# Altium project COM Board.PrjPcb (part 2 of 2)
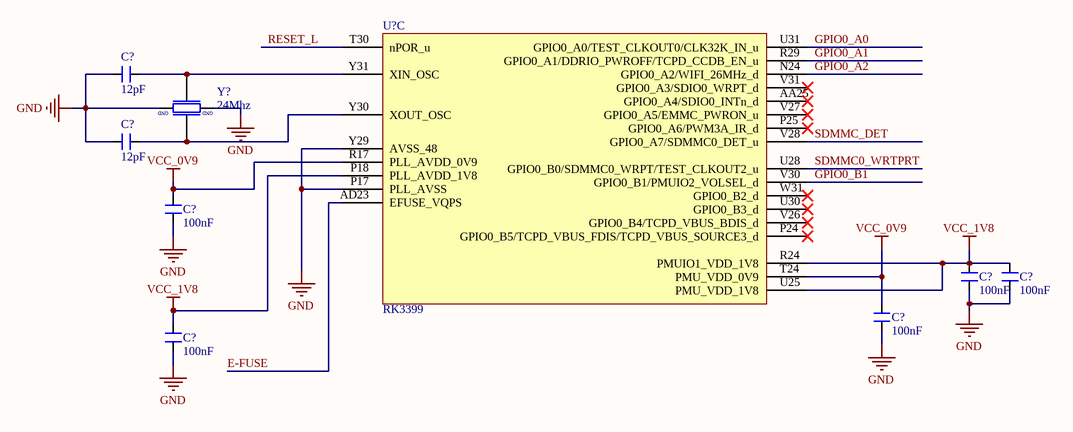
[diagram p9: System PMU pins.SchDoc]

## Nets that join several sheets
GND: RK3399_LPDDR4_Pins (R?#1.1 R?#2.1), SDRAM0 (58 pins), SDRAM_1 (58 pins), EMMC_RK3399 (22 pins), PowerPins_RK3399 (232 pins), PMIC_RK808 (47 pins), System PMU pins (11 pins)
VCC: SDRAM0 (52 pins), SDRAM_1 (52 pins)
VCC_1V8: PMIC_RK808 (C?#18.2 C?#19.2 L?#1.2 U?#10.63), System PMU pins (6 pins)
DDR0_A0: RK3399_LPDDR4_Pins (U?#1.F2), SDRAM0 (U?#4.H2 U?#4.R2)
DDR0_A1: RK3399_LPDDR4_Pins (U?#1.F1), SDRAM0 (U?#4.J2 U?#4.P2)
DDR0_A2: RK3399_LPDDR4_Pins (U?#1.G1), SDRAM0 (U?#4.H9 U?#4.R9)
DDR0_A3: RK3399_LPDDR4_Pins (U?#1.G2), SDRAM0 (U?#4.H10 U?#4.R10)
DDR0_A4: RK3399_LPDDR4_Pins (U?#1.H2), SDRAM0 (U?#4.H11 U?#4.R11)
DDR0_A5: RK3399_LPDDR4_Pins (U?#1.H1), SDRAM0 (U?#4.J11 U?#4.P11)
DDR0_CKE0: RK3399_LPDDR4_Pins (U?#1.E1), SDRAM0 (U?#4.J4 U?#4.P4)
DDR0_CKE1: RK3399_LPDDR4_Pins (U?#1.F5), SDRAM0 (U?#4.J5 U?#4.P5)
DDR0_CLK0_N: RK3399_LPDDR4_Pins (U?#1.J4), SDRAM0 (U?#4.J9)
DDR0_CLK0_P: RK3399_LPDDR4_Pins (U?#1.H4), SDRAM0 (U?#4.J8)
DDR0_CLK1_N: RK3399_LPDDR4_Pins (U?#1.J5), SDRAM0 (U?#4.P9)
DDR0_CLK1_P: RK3399_LPDDR4_Pins (U?#1.H5), SDRAM0 (U?#4.P8)
DDR0_CS0N: RK3399_LPDDR4_Pins (U?#1.M6), SDRAM0 (U?#4.H4)
DDR0_CS1N: RK3399_LPDDR4_Pins (U?#1.B1), SDRAM0 (U?#4.H3)
DDR0_CS2N: RK3399_LPDDR4_Pins (U?#1.M5), SDRAM0 (U?#4.R4)
DDR0_CS3N: RK3399_LPDDR4_Pins (U?#1.C2), SDRAM0 (U?#4.R3)
DDR0_D0: RK3399_LPDDR4_Pins (U?#1.AB2), SDRAM0 (U?#4.B2)
DDR0_D1: RK3399_LPDDR4_Pins (U?#1.AB1), SDRAM0 (U?#4.C2)
DDR0_D2: RK3399_LPDDR4_Pins (U?#1.AA2), SDRAM0 (U?#4.E2)
DDR0_D3: RK3399_LPDDR4_Pins (U?#1.AA1), SDRAM0 (U?#4.F2)
DDR0_D4: RK3399_LPDDR4_Pins (U?#1.Y2), SDRAM0 (U?#4.F4)
DDR0_D5: RK3399_LPDDR4_Pins (U?#1.Y1), SDRAM0 (U?#4.E4)
DDR0_D6: RK3399_LPDDR4_Pins (U?#1.W1), SDRAM0 (U?#4.C4)
DDR0_D7: RK3399_LPDDR4_Pins (U?#1.W2), SDRAM0 (U?#4.B4)
DDR0_D8: RK3399_LPDDR4_Pins (U?#1.AF2), SDRAM0 (U?#4.B11)
DDR0_D9: RK3399_LPDDR4_Pins (U?#1.AE2), SDRAM0 (U?#4.C11)
DDR0_D10: RK3399_LPDDR4_Pins (U?#1.AF1), SDRAM0 (U?#4.E11)
DDR0_D11: RK3399_LPDDR4_Pins (U?#1.AD2), SDRAM0 (U?#4.F11)
DDR0_D12: RK3399_LPDDR4_Pins (U?#1.AE1), SDRAM0 (U?#4.F9)
DDR0_D13: RK3399_LPDDR4_Pins (U?#1.AD1), SDRAM0 (U?#4.E9)
DDR0_D14: RK3399_LPDDR4_Pins (U?#1.AC1), SDRAM0 (U?#4.C9)
DDR0_D15: RK3399_LPDDR4_Pins (U?#1.AC2), SDRAM0 (U?#4.B9)
DDR0_D16: RK3399_LPDDR4_Pins (U?#1.V1), SDRAM0 (U?#4.AA2)
DDR0_D17: RK3399_LPDDR4_Pins (U?#1.V2), SDRAM0 (U?#4.Y2)
DDR0_D18: RK3399_LPDDR4_Pins (U?#1.U1), SDRAM0 (U?#4.V2)
DDR0_D19: RK3399_LPDDR4_Pins (U?#1.U2), SDRAM0 (U?#4.U2)
DDR0_D20: RK3399_LPDDR4_Pins (U?#1.T1), SDRAM0 (U?#4.U4)
DDR0_D21: RK3399_LPDDR4_Pins (U?#1.T2), SDRAM0 (U?#4.V4)
DDR0_D22: RK3399_LPDDR4_Pins (U?#1.R2), SDRAM0 (U?#4.Y4)
DDR0_D23: RK3399_LPDDR4_Pins (U?#1.R1), SDRAM0 (U?#4.AA4)
DDR0_D24: RK3399_LPDDR4_Pins (U?#1.P1), SDRAM0 (U?#4.AA11)
DDR0_D25: RK3399_LPDDR4_Pins (U?#1.P2), SDRAM0 (U?#4.Y11)
DDR0_D26: RK3399_LPDDR4_Pins (U?#1.N1), SDRAM0 (U?#4.V11)
DDR0_D27: RK3399_LPDDR4_Pins (U?#1.M1), SDRAM0 (U?#4.U11)
DDR0_D28: RK3399_LPDDR4_Pins (U?#1.N2), SDRAM0 (U?#4.U9)
DDR0_D29: RK3399_LPDDR4_Pins (U?#1.L1), SDRAM0 (U?#4.V9)
DDR0_D30: RK3399_LPDDR4_Pins (U?#1.M2), SDRAM0 (U?#4.Y9)
DDR0_D31: RK3399_LPDDR4_Pins (U?#1.L2), SDRAM0 (U?#4.AA9)
DDR0_DM0: RK3399_LPDDR4_Pins (U?#1.Y5), SDRAM0 (U?#4.C3)
DDR0_DM1: RK3399_LPDDR4_Pins (U?#1.AC5), SDRAM0 (U?#4.C10)
DDR0_DM2: RK3399_LPDDR4_Pins (U?#1.U5), SDRAM0 (U?#4.Y3)
DDR0_DM3: RK3399_LPDDR4_Pins (U?#1.P5), SDRAM0 (U?#4.Y10)
DDR0_DQS0_N: RK3399_LPDDR4_Pins (U?#1.AA4), SDRAM0 (U?#4.E3)
DDR0_DQS0_P: RK3399_LPDDR4_Pins (U?#1.Y4), SDRAM0 (U?#4.D3)
DDR0_DQS1_N: RK3399_LPDDR4_Pins (U?#1.AD4), SDRAM0 (U?#4.E10)
DDR0_DQS1_P: RK3399_LPDDR4_Pins (U?#1.AC4), SDRAM0 (U?#4.D10)
DDR0_DQS2_N: RK3399_LPDDR4_Pins (U?#1.V4), SDRAM0 (U?#4.V3)
DDR0_DQS2_P: RK3399_LPDDR4_Pins (U?#1.U4), SDRAM0 (U?#4.W3)
DDR0_DQS3_N: RK3399_LPDDR4_Pins (U?#1.R4), SDRAM0 (U?#4.V10)
DDR0_DQS3_P: RK3399_LPDDR4_Pins (U?#1.P4), SDRAM0 (U?#4.W10)
DDR1_A0: RK3399_LPDDR4_Pins (U?#2.B10), SDRAM_1 (U?#6.H2 U?#6.R2)
DDR1_A1: RK3399_LPDDR4_Pins (U?#2.A10), SDRAM_1 (U?#6.J2 U?#6.P2)
DDR1_A2: RK3399_LPDDR4_Pins (U?#2.B9), SDRAM_1 (U?#6.H9 U?#6.R9)
DDR1_A3: RK3399_LPDDR4_Pins (U?#2.A9), SDRAM_1 (U?#6.H10 U?#6.R10)
DDR1_A4: RK3399_LPDDR4_Pins (U?#2.B8), SDRAM_1 (U?#6.H11 U?#6.R11)
DDR1_A5: RK3399_LPDDR4_Pins (U?#2.A8), SDRAM_1 (U?#6.J11 U?#6.P11)
DDR1_CKE0: RK3399_LPDDR4_Pins (U?#2.A5), SDRAM_1 (U?#6.J4 U?#6.P4)
DDR1_CKE1: RK3399_LPDDR4_Pins (U?#2.E6), SDRAM_1 (U?#6.J5 U?#6.P5)
DDR1_CLK0_N: RK3399_LPDDR4_Pins (U?#2.D8), SDRAM_1 (U?#6.J9)
DDR1_CLK0_P: RK3399_LPDDR4_Pins (U?#2.D9), SDRAM_1 (U?#6.J8)
DDR1_CLK1_N: RK3399_LPDDR4_Pins (U?#2.E8), SDRAM_1 (U?#6.P9)
DDR1_CLK1_P: RK3399_LPDDR4_Pins (U?#2.E9), SDRAM_1 (U?#6.P8)
DDR1_CS0N: RK3399_LPDDR4_Pins (U?#2.F12), SDRAM_1 (U?#6.H4)
DDR1_CS1N: RK3399_LPDDR4_Pins (U?#2.A2), SDRAM_1 (U?#6.H3)
DDR1_CS2N: RK3399_LPDDR4_Pins (U?#2.F11), SDRAM_1 (U?#6.R4)
DDR1_CS3N: RK3399_LPDDR4_Pins (U?#2.B3), SDRAM_1 (U?#6.R3)
DDR1_D0: RK3399_LPDDR4_Pins (U?#2.B15), SDRAM_1 (U?#6.B2)
DDR1_D1: RK3399_LPDDR4_Pins (U?#2.A15), SDRAM_1 (U?#6.C2)
DDR1_D2: RK3399_LPDDR4_Pins (U?#2.B16), SDRAM_1 (U?#6.E2)
DDR1_D3: RK3399_LPDDR4_Pins (U?#2.A16), SDRAM_1 (U?#6.F2)
DDR1_D4: RK3399_LPDDR4_Pins (U?#2.B17), SDRAM_1 (U?#6.F4)
DDR1_D5: RK3399_LPDDR4_Pins (U?#2.A17), SDRAM_1 (U?#6.E4)
DDR1_D6: RK3399_LPDDR4_Pins (U?#2.A18), SDRAM_1 (U?#6.C4)
DDR1_D7: RK3399_LPDDR4_Pins (U?#2.B18), SDRAM_1 (U?#6.B4)
DDR1_D8: RK3399_LPDDR4_Pins (U?#2.B11), SDRAM_1 (U?#6.B11)
DDR1_D9: RK3399_LPDDR4_Pins (U?#2.B12), SDRAM_1 (U?#6.C11)
DDR1_D10: RK3399_LPDDR4_Pins (U?#2.A11), SDRAM_1 (U?#6.E11)
DDR1_D11: RK3399_LPDDR4_Pins (U?#2.B13), SDRAM_1 (U?#6.F11)
DDR1_D12: RK3399_LPDDR4_Pins (U?#2.A12), SDRAM_1 (U?#6.F9)
DDR1_D13: RK3399_LPDDR4_Pins (U?#2.A13), SDRAM_1 (U?#6.E9)
DDR1_D14: RK3399_LPDDR4_Pins (U?#2.A14), SDRAM_1 (U?#6.C9)
DDR1_D15: RK3399_LPDDR4_Pins (U?#2.B14), SDRAM_1 (U?#6.B9)
DDR1_D16: RK3399_LPDDR4_Pins (U?#2.A19), SDRAM_1 (U?#6.AA2)
DDR1_D17: RK3399_LPDDR4_Pins (U?#2.B19), SDRAM_1 (U?#6.Y2)
DDR1_D18: RK3399_LPDDR4_Pins (U?#2.A20), SDRAM_1 (U?#6.V2)
DDR1_D19: RK3399_LPDDR4_Pins (U?#2.B20), SDRAM_1 (U?#6.U2)
DDR1_D20: RK3399_LPDDR4_Pins (U?#2.A21), SDRAM_1 (U?#6.U4)
DDR1_D21: RK3399_LPDDR4_Pins (U?#2.B21), SDRAM_1 (U?#6.V4)
DDR1_D22: RK3399_LPDDR4_Pins (U?#2.B22), SDRAM_1 (U?#6.Y4)
DDR1_D23: RK3399_LPDDR4_Pins (U?#2.A22), SDRAM_1 (U?#6.AA4)
DDR1_D24: RK3399_LPDDR4_Pins (U?#2.A23), SDRAM_1 (U?#6.AA11)
DDR1_D25: RK3399_LPDDR4_Pins (U?#2.B23), SDRAM_1 (U?#6.Y11)
DDR1_D26: RK3399_LPDDR4_Pins (U?#2.A24), SDRAM_1 (U?#6.V11)
DDR1_D27: RK3399_LPDDR4_Pins (U?#2.A25), SDRAM_1 (U?#6.U11)
DDR1_D28: RK3399_LPDDR4_Pins (U?#2.B24), SDRAM_1 (U?#6.U9)
DDR1_D29: RK3399_LPDDR4_Pins (U?#2.A26), SDRAM_1 (U?#6.V9)
DDR1_D30: RK3399_LPDDR4_Pins (U?#2.B25), SDRAM_1 (U?#6.Y9)
DDR1_D31: RK3399_LPDDR4_Pins (U?#2.B26), SDRAM_1 (U?#6.AA9)
DDR1_DM0: RK3399_LPDDR4_Pins (U?#2.E17), SDRAM_1 (U?#6.C3)
DDR1_DM1: RK3399_LPDDR4_Pins (U?#2.E14), SDRAM_1 (U?#6.C10)
DDR1_DM2: RK3399_LPDDR4_Pins (U?#2.E20), SDRAM_1 (U?#6.Y3)
DDR1_DM3: RK3399_LPDDR4_Pins (U?#2.E23), SDRAM_1 (U?#6.Y10)
DDR1_DQS0_N: RK3399_LPDDR4_Pins (U?#2.D17), SDRAM_1 (U?#6.E3)
DDR1_DQS0_P: RK3399_LPDDR4_Pins (U?#2.D18), SDRAM_1 (U?#6.D3)
DDR1_DQS1_N: RK3399_LPDDR4_Pins (U?#2.D14), SDRAM_1 (U?#6.E10)
DDR1_DQS1_P: RK3399_LPDDR4_Pins (U?#2.D15), SDRAM_1 (U?#6.D10)
DDR1_DQS2_N: RK3399_LPDDR4_Pins (U?#2.D20), SDRAM_1 (U?#6.V3)
DDR1_DQS2_P: RK3399_LPDDR4_Pins (U?#2.D21), SDRAM_1 (U?#6.W3)
DDR1_DQS3_N: RK3399_LPDDR4_Pins (U?#2.D23), SDRAM_1 (U?#6.V10)
DDR1_DQS3_P: RK3399_LPDDR4_Pins (U?#2.D24), SDRAM_1 (U?#6.W10)
EMMC_CLK: EMMC_RK3399 (U?#7.M6), EMMC-SDMMC-PCIe-ADC (U?#12.L28)
EMMC_CMD: EMMC_RK3399 (U?#7.M5), EMMC-SDMMC-PCIe-ADC (U?#12.J31)
EMMC_D0: EMMC_RK3399 (U?#7.A3), EMMC-SDMMC-PCIe-ADC (U?#12.J28)
EMMC_D1: EMMC_RK3399 (U?#7.A4), EMMC-SDMMC-PCIe-ADC (U?#12.J29)
EMMC_D2: EMMC_RK3399 (U?#7.A5), EMMC-SDMMC-PCIe-ADC (U?#12.J30)
EMMC_D3: EMMC_RK3399 (U?#7.B2), EMMC-SDMMC-PCIe-ADC (U?#12.J25)
EMMC_D4: EMMC_RK3399 (U?#7.B3), EMMC-SDMMC-PCIe-ADC (U?#12.J26)
EMMC_D5: EMMC_RK3399 (U?#7.B4), EMMC-SDMMC-PCIe-ADC (U?#12.J27)
EMMC_D6: EMMC_RK3399 (U?#7.B5), EMMC-SDMMC-PCIe-ADC (U?#12.L31)
EMMC_D7: EMMC_RK3399 (U?#7.B6), EMMC-SDMMC-PCIe-ADC (U?#12.K30)
EMMC_DQS: EMMC_RK3399 (U?#7.H5), EMMC-SDMMC-PCIe-ADC (U?#12.K31)
RESET_L: PMIC_RK808 (U?#10.20), System PMU pins (U?#15.T30)